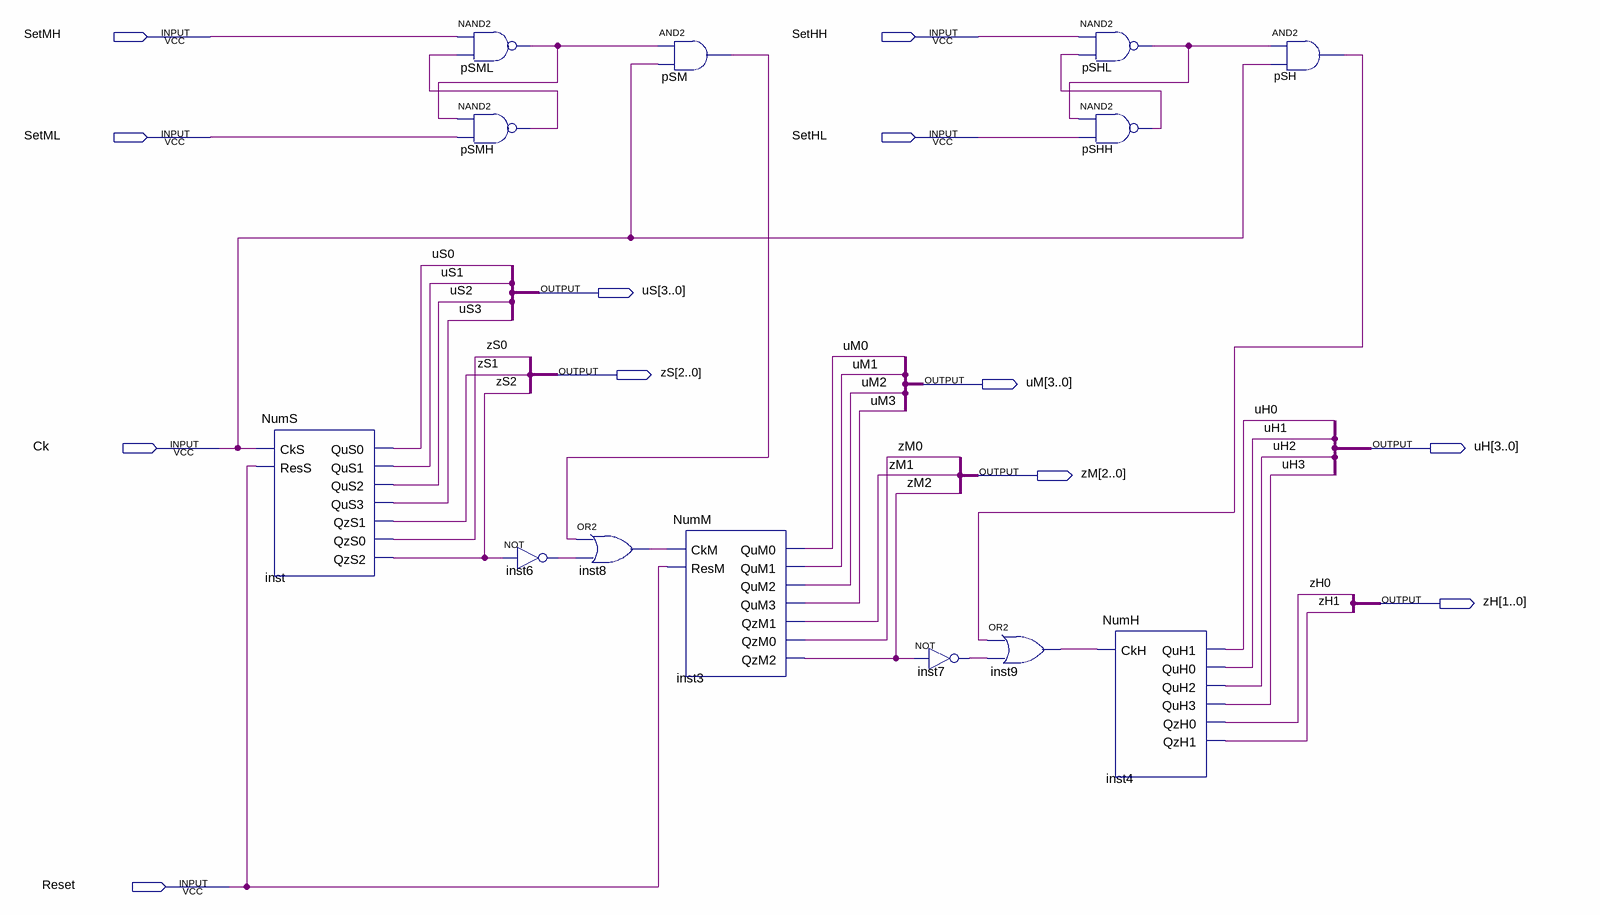
[diagram p0: schematic sheet]
// Quartus schematic BLNum.bdf as structural Verilog: 13 symbols, 12 pins
module BLNum (
  input  SetMH,
  input  SetHH,
  input  SetML,
  input  SetHL,
  input  Ck,
  input  Reset,
  output [3:0] uS,
  output [2:0] zS,
  output [3:0] uM,
  output [3:0] uH,
  output [2:0] zM,
  output [1:0] zH
);

  wire inst6_out, inst7_out, inst8_out, inst9_out, pSH_out, pSHH_out, pSHL_out, pSM_out, pSMH_out, pSML_out;

  NumS inst (
    .CkS(Ck), .ResS(Reset), .QuS0(uS[0]), .QuS1(uS[1]), .QuS2(uS[2]), .QuS3(uS[3]), .QzS1(zS[1]),
    .QzS0(zS[0]), .QzS2(zS[2]));
  nand pSML (pSML_out, SetMH, pSMH_out);
  nand pSMH (pSMH_out, pSML_out, SetML);
  not inst6 (inst6_out, zS[2]);
  or inst8 (inst8_out, pSM_out, inst6_out);
  and pSM (pSM_out, pSML_out, Ck);
  NumM inst3 (
    .CkM(inst8_out), .ResM(Reset), .QuM0(uM[0]), .QuM1(uM[1]), .QuM2(uM[2]), .QuM3(uM[3]), .QzM1(zM[1]),
    .QzM0(zM[0]), .QzM2(zM[2]));
  not inst7 (inst7_out, zM[2]);
  or inst9 (inst9_out, pSH_out, inst7_out);
  nand pSHL (pSHL_out, SetHH, pSHH_out);
  nand pSHH (pSHH_out, pSHL_out, SetHL);
  NumH inst4 (.CkH(inst9_out), .QuH1(uH[0]), .QuH0(uH[1]), .QuH2(uH[2]), .QuH3(uH[3]), .QzH0(zH[0]), .QzH1(zH[1]));
  and pSH (pSH_out, pSHL_out, Ck);
endmodule
